# Altium schematic sheet Sheet4.SchDoc
size A3; SheetNumber: 4
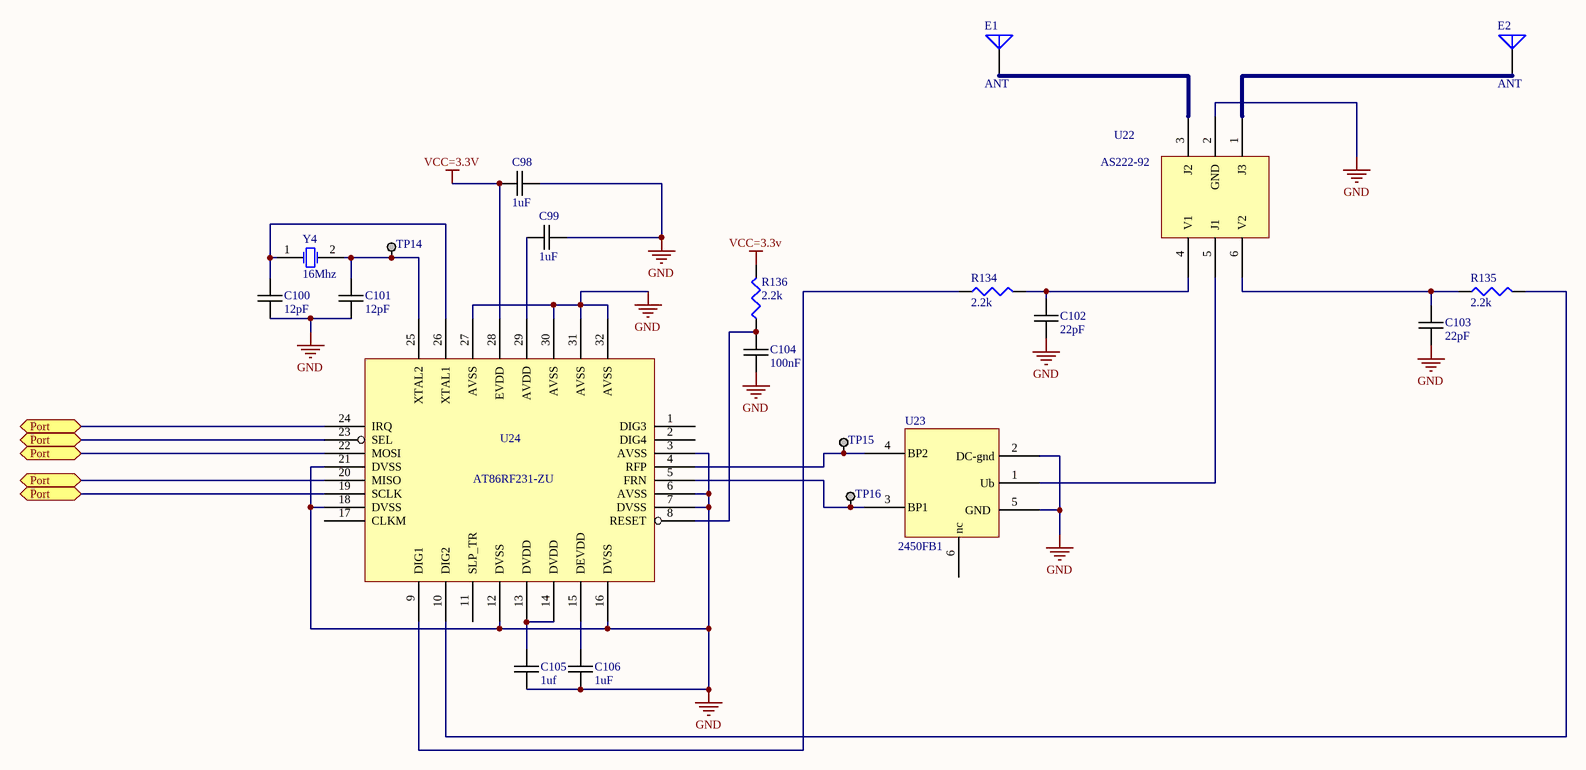
[diagram p0: Sheet4.SchDoc]

## Parts
C98  1uF  [0805C-TBD]
C99  1uF  [0805C-TBD]
C100  12pF  [0805C-TBD]
C101  12pF  [0805C-TBD]
C102  22pF  [0805C-TBD]
C103  22pF  [0805C-TBD]
C104  100nF  [0805C-TBD]
C105  1uf  [0805C-TBD]
C106  1uF  [0805C-TBD]
E1  ANT  [PIN1]
E2  ANT  [PIN1]
R134  2.2k  [J1-0603]
R135  2.2k  [J1-0603]
R136  2.2k  [J1-0603]
TP14  TESTPOINT  [TESTPOINT]  (value not drawn)
TP15  TESTPOINT  [TESTPOINT]  (value not drawn)
TP16  TESTPOINT  [TESTPOINT]  (value not drawn)
U22  AS222-92  [AS222-92]
U23  2450FB1  [2450FB1]
U24  AT86RF231-ZU  [32QN2_N]
Y4  16Mhz  [R38]

## Ports
Port

## Nets
GND: C98.1 C99.2 C100.2 C101.2 C102.1 C103.1 C104.1 C105.1 C106.1 U22.2(GND) U23.2(DC-gnd) U23.5(GND) U24.3(AVSS) U24.6(AVSS) U24.7(DVSS) U24.12(DVSS) U24.16(DVSS) U24.18(DVSS) U24.21(DVSS) U24.27(AVSS) U24.30(AVSS) U24.31(AVSS) U24.32(AVSS)
VCC=3.3v: C98.2 R136.2 U24.28(EVDD)
Port: U24.19(SCLK) U24.20(MISO) U24.22(MOSI) U24.23(SEL) U24.24(IRQ) ; port Port
NetC99_1: C99.1 U24.29(AVDD)
NetC100_1: C100.1 U24.26(XTAL1) Y4.1(OSC1)
NetC101_1: C101.1 TP14.1 U24.25(XTAL2) Y4.2(OSC2)
NetC102_2: C102.2 R134.2 U22.4(V1)
NetC103_2: C103.2 R135.1 U22.6(V2)
NetC104_2: C104.2 R136.1 U24.8(RESET)
NetC105_2: C105.2 U24.13(DVDD) U24.14(DVDD)
NetC106_2: C106.2 U24.15(DEVDD)
NetE1_1: E1.1(A) U22.3(J2)
NetE2_1: E2.1(A) U22.1(J3)
NetR134_1: R134.1 U24.9(DIG1)
NetR135_2: R135.2 U24.10(DIG2)
NetTP15_1: TP15.1 U23.4(BP2) U24.4(RFP)
NetTP16_1: TP16.1 U23.3(BP1) U24.5(FRN)
NetU22_5: U22.5(J1) U23.1(Ub)

Not connected (* = marked no-connect by the designer): U23 6(nc); U24 1(DIG3) 2(DIG4) 11(SLP_TR) 17(CLKM)

## Library data of the parts
C98-C102 C104 C105 = 0805C-18PF-50V-C0G-JOH: CAPACITOR 0805 CERAMIC; Supplier 1: Digi-Key; Supplier Part Number 1: 709-1171-2-ND
  C98 C99 C105: Value: 1uF; mfr PN: *; Package Reference: 0805-TBD
  C102: Value: 22pF; mfr PN: *; Package Reference: 0805-TBD
  C104: Value: 100nF; mfr PN: *; Package Reference: 0805-TBD
C103 = 0805C-18PF-50V-C0G-JOH: CAPACITOR 0805 CERAMIC; Value: 10n; Supplier 1: Digi-Key; Supplier Part Number 1: 709-1171-2-ND; mfr PN: *; Package Reference: 0805-TBD
C106 = 0805C-18PF-50V-C0G-JOH: CAPACITOR 0805 CERAMIC; Value: 22pF; Supplier 1: Digi-Key; Supplier Part Number 1: 709-1171-2-ND; mfr PN: *; Package Reference: 0805-TBD
E1 E2 = Antenna: Generic Antenna; Published: 24-Mar-1999; LatestRevisionDate: 17-Jul-2002; LatestRevisionNote: Re-released for DXP Platform.; PackageReference: PIN1; Publisher: Altium Limited
R134 R136 = Res3: Resistor; Value: 2.2k/.125W 1%; Published: 8-Jun-2000; LatestRevisionDate: 29-May-2009; LatestRevisionNote: IPC-7351 Footprint Added.; PackageReference: J1-0603; Publisher: Altium Limited; PackageDescription: Chip Resistor
R135 = Res3: Resistor; Value: 32.2k/.125W 1%; Published: 8-Jun-2000; LatestRevisionDate: 29-May-2009; LatestRevisionNote: IPC-7351 Footprint Added.; PackageReference: J1-0603; Publisher: Altium Limited; PackageDescription: Chip Resistor
TP14-TP16 = TESTPOINT: TESTPOINT SCOPE GRABBER; Manufacturer Part Number: 5010; Manufacturer: Keystone Electronics; Reel: TH; Supplier 1: Digi-Key; Supplier Part Number 1: 5010K-ND
U23 = 2450FB1: currTrans
U24 = AT86RF231-ZU: AVR Low Power 2.4 GHz Transceiver, 32-Pin QFN Pkg, Industrial Temp (-40 to +85 degC), Tape and Reel, Pb-Free, Halogen-Free, 5000 pcs; Published: 20-Sep-2010; DatasheetVersion: revC, Sep-2009; PackageVersion: revA, Nov-2007; PackageReference: 32QN2; Publisher: Altium Limited; PackageDescription: 32-Pin Quad Flat No-Lead (QFN) Sawn,  5 x 5 x 1.0 mm Body, Pitch 0.50 mm, 3.10mm Exposed Pad; Supplier 1: Digi-Key; Supplier Part Number 1: AT86RF231-ZU-ND; Supplier 2: Farnell; Supplier Part Number 2: 1748493; Supplier 3: Mouser; Supplier Part Number 3: 556-AT86RF231-ZU; Code_JEDEC: MO-220VHHD-6; ComponentLink1Description: AT86RF231 Datasheet; ComponentLink1URL: http://www.atmel.com/dyn/resources/prod_documents/doc8111.pdf; ComponentLink2Description: Atmel.com Home; ComponentLink2URL: http://www.atmel.com
Y4 = XTAL: Crystal Oscillator; Published: 8-Jun-2000; LatestRevisionDate: 17-Jul-2002; LatestRevisionNote: Re-released for DXP Platform.; PackageReference: R38; Publisher: Altium Limited; PackageDescription: Crystal, Thru-Hole; 2 Leads; Body 3.1 x 8.2 mm (Dia.xH); Value: 16MHz